# EAGLE design Training_Board (EAGLE 9.1.1)
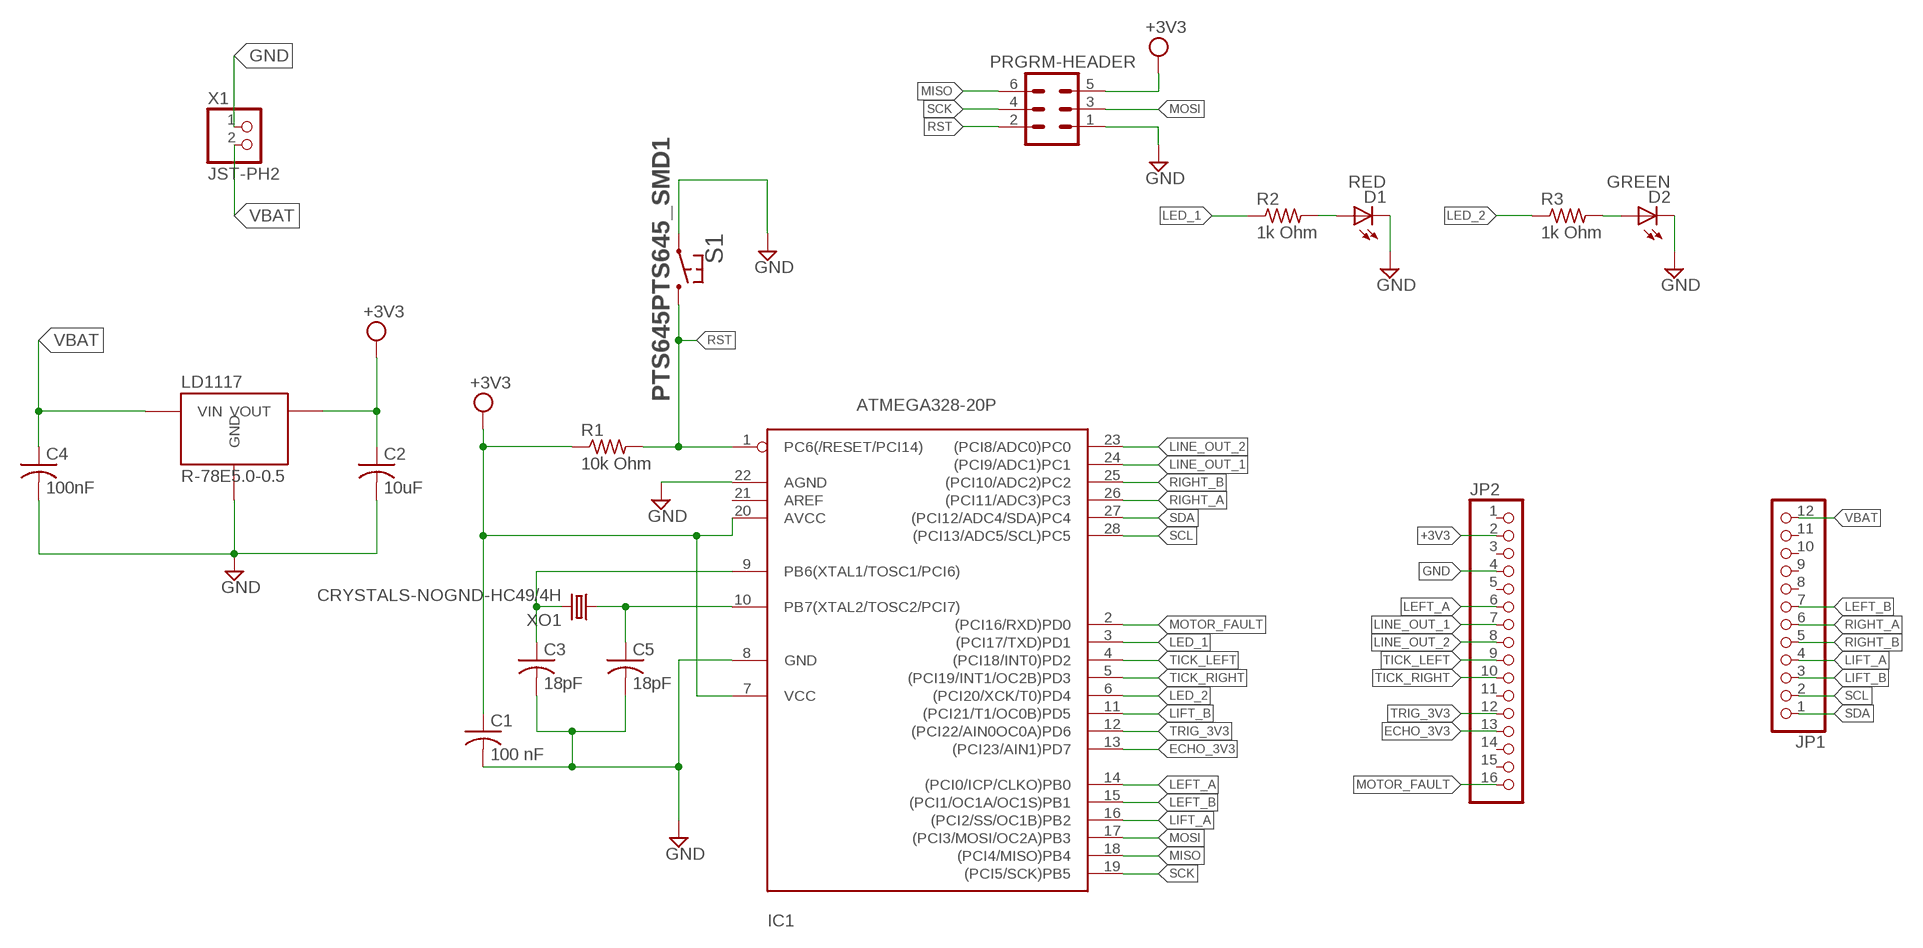
[diagram p0: schematic, sheet 1]

## Parts
C1  100 nF  C-USC0603  [C0603]
C2  10uF  C-USC0603  [C0603]
C3  18pF  C-USC0603  [C0603]
C4  100nF  C-USC0603  [C0603]
C5  18pF  C-USC0603  [C0603]
D1  RED  LEDCHIP-LED0603  [CHIP-LED0603]
D2  GREEN  LEDCHIP-LED0603  [CHIP-LED0603]
IC1  ATMEGA328-20P  [DIL28-3]
JP1  PINHD-1X12  [1X12]
JP2  PINHD-1X16  [1X16]
LD1117  R-78E5.0-0.5  [R-78E]
PRGRM-HEADER  MA03-2  [MA03-2]
R1  10k Ohm  R-US_R0603  [R0603]
R2  1k Ohm  R-US_M0805  [M0805]
R3  1k Ohm  R-US_M0805  [M0805]
S1  PTS645PTS645_SMD1  [PTS645_SMD]
X1  JST-PH2  [JST-PH]
XO1  CRYSTALS-NOGND-HC49/4H  [HC49]

## Nets
+3V3: C1.1 C2.1 IC1.7(VCC) IC1.20(AVCC) JP2.2 LD1117.3(VOUT) PRGRM-HEADER.5 R1.1
ECHO_3V3: IC1.13((PCI23/AIN1)PD7) JP2.13
GND: C1.2 C2.2 C3.2 C4.2 C5.2 D1.C D2.C IC1.8(GND) IC1.22(AGND) JP2.4 LD1117.2(GND) PRGRM-HEADER.1 S1.P$1 S1.P$2 X1.1
LED_1: IC1.3((PCI17/TXD)PD1) R2.1
LED_2: IC1.6((PCI20/XCK/T0)PD4) R3.1
LEFT_A: IC1.14((PCI0/ICP/CLKO)PB0) JP2.6
LEFT_B: IC1.15((PCI1/OC1A/OC1S)PB1) JP1.7
LIFT_A: IC1.16((PCI2/SS/OC1B)PB2) JP1.4
LIFT_B: IC1.11((PCI21/T1/OC0B)PD5) JP1.3
LINE_OUT_1: IC1.24((PCI9/ADC1)PC1) JP2.7
LINE_OUT_2: IC1.23((PCI8/ADC0)PC0) JP2.8
MISO: IC1.18((PCI4/MISO)PB4) PRGRM-HEADER.6
MOSI: IC1.17((PCI3/MOSI/OC2A)PB3) PRGRM-HEADER.3
MOTOR_FAULT: IC1.2((PCI16/RXD)PD0) JP2.16
N$1: C3.1 IC1.9(PB6(XTAL1/TOSC1/PCI6)) XO1.2
N$2: D2.A R3.2
N$3: D1.A R2.2
N$4: C5.1 IC1.10(PB7(XTAL2/TOSC2/PCI7)) XO1.1
RIGHT_A: IC1.26((PCI11/ADC3)PC3) JP1.6
RIGHT_B: IC1.25((PCI10/ADC2)PC2) JP1.5
RST: IC1.1(PC6(/RESET/PCI14)) PRGRM-HEADER.2 R1.2 S1.P$3 S1.P$4
SCK: IC1.19((PCI5/SCK)PB5) PRGRM-HEADER.4
SCL: IC1.28((PCI13/ADC5/SCL)PC5) JP1.2
SDA: IC1.27((PCI12/ADC4/SDA)PC4) JP1.1
TICK_LEFT: IC1.4((PCI18/INT0)PD2) JP2.9
TICK_RIGHT: IC1.5((PCI19/INT1/OC2B)PD3) JP2.10
TRIG_3V3: IC1.12((PCI22/AIN0OC0A)PD6) JP2.12
VBAT: C4.1 JP1.12 LD1117.1(VIN) X1.2
Unconnected: IC1.21(AREF) JP1.8 JP1.9 JP1.10 JP1.11 JP2.1 JP2.3 JP2.5 JP2.11 JP2.14 JP2.15

## Library data of the parts
C1 C3 C5 = resistor:C-US: CAPACITOR, American symbol
C2 C4 = rcl:C-US: CAPACITOR, American symbol; SPICEPREFIX: C
D1 D2 = led:LED: LED OSRAM: - CHIPLED LG R971, LG N971, LY N971, LG Q971, LY Q971, LO R971, LY R971 LH N974, LH R974 LS Q976, LO Q976, LY Q976 LO Q996 - Hyper CHIPLED LW Q18S LB Q993, LB Q99A, LB R99A - SideLED LS A670, LO A670, LY A670, LG A670, LP A670 LB A673, LV A673, LT A673, LW A673 LH A674 LY A675 LS A676, LA A676, LO A676, LY A676, LW A676 LS A679, LY A679, LG A679 - Hyper Micro SIDELED® LS Y876, LA Y876, LO Y876, LY Y876 LT Y87S - SmartLED LW L88C, LW L88S LB L89C, LB L89S, LG L890 LS L89K, LO L89K, LY L89K LS L896, LA L896, LO L896, LY L896 - TOPLED LS T670, LO T670, LY T670, LG T670, LP T670 LSG T670, LSP T670, LSY T670, LOP T670, LYG T670 LG T671, LOG T671, LSG T671 LB T673, LV T673, LT T673, LW T673 LH T674 LS T676, LA T676, LO T676, LY T676, LB T676, LH T676, LSB T676, LW T676 LB T67C, LV T67C, LT T67C, LS T67K, LO T67K, LY T67K, LW E67C LS E67B, LA E67B, LO E67B, LY E67B, LB E67C, LV E67C, LT E67C LW T67C LS T679, LY T679, LG T679 LS T770, LO T770, LY T770, LG T770, LP T770 LB T773, LV T773, LT T773, LW T773 LH T774 LS E675, LA E675, LY E675, LS T675 LS T776, LA T776, LO T776, LY T776, LB T776 LHGB T686 LT T68C, LB T68C - Hyper Mini TOPLED® LB M676 - Mini TOPLED Santana® LG M470 LS M47K, LO M47K, LY M47K Source: http://www.osram.convergy.de LUXEON: - LUMILED® LXK2-PW12-R00, LXK2-PW12-S00, LXK2-PW14-U00, LXK2-PW14-V00 LXK2-PM12-R00, LXK2-PM12-S00, LXK2-PM14-U00 LXK2-PE12-Q00, LXK2-PE12-R00, LXK2-PE12-S00, LXK2-PE14-T00, LXK2-PE14-U00 LXK2-PB12-K00, LXK2-PB12-L00, LXK2-PB12-M00, LXK2-PB14-N00, LXK2-PB14-P00, LXK2-PB14-Q00 LXK2-PR12-L00, LXK2-PR12-M00, LXK2-PR14-Q00, LXK2-PR14-R00 LXK2-PD12-Q00, LXK2-PD12-R00, LXK2-PD12-S00 LXK2-PH12-R00, LXK2-PH12-S00 LXK2-PL12-P00, LXK2-PL12-Q00, LXK2-PL12-R00 Source: www.luxeon.com KINGBRIGHT: KA-3528ASYC Source: www.kingbright.com
IC1 = atmega328:ATMEGA328*P: MICROCONTROLLER 32 kBytes FLASH 2 kBytes SRAM 1 kBytes EEPROM USART 8-channel 10 bit ADC
JP1 = pinhead:PINHD-1X12: PIN HEADER
JP2 = pinhead:PINHD-1X16: PIN HEADER
LD1117 = RoboJackets-PowerICs:R-78E5.0-0.5
PRGRM-HEADER = con-lstb:MA03-2: PIN HEADER; OC_FARNELL: unknown; OC_NEWARK: unknown
R1 = resistor:R-US_: RESISTOR, American symbol
R2 R3 = rcl:R-US_: RESISTOR, American symbol; SPICEPREFIX: R
S1 = RoboJackets-Switches:PTS645: Tactile Momentary Pushbutton with thru-hole legs. https://www.ckswitches.com/media/1471/pts645.pdf
X1 = Trainii:JST-PH2
XO1 = IQD-Frequency-Products:CRYSTALS-NOGND: CRYSTALS CAN NOT GROUNDED

## Board
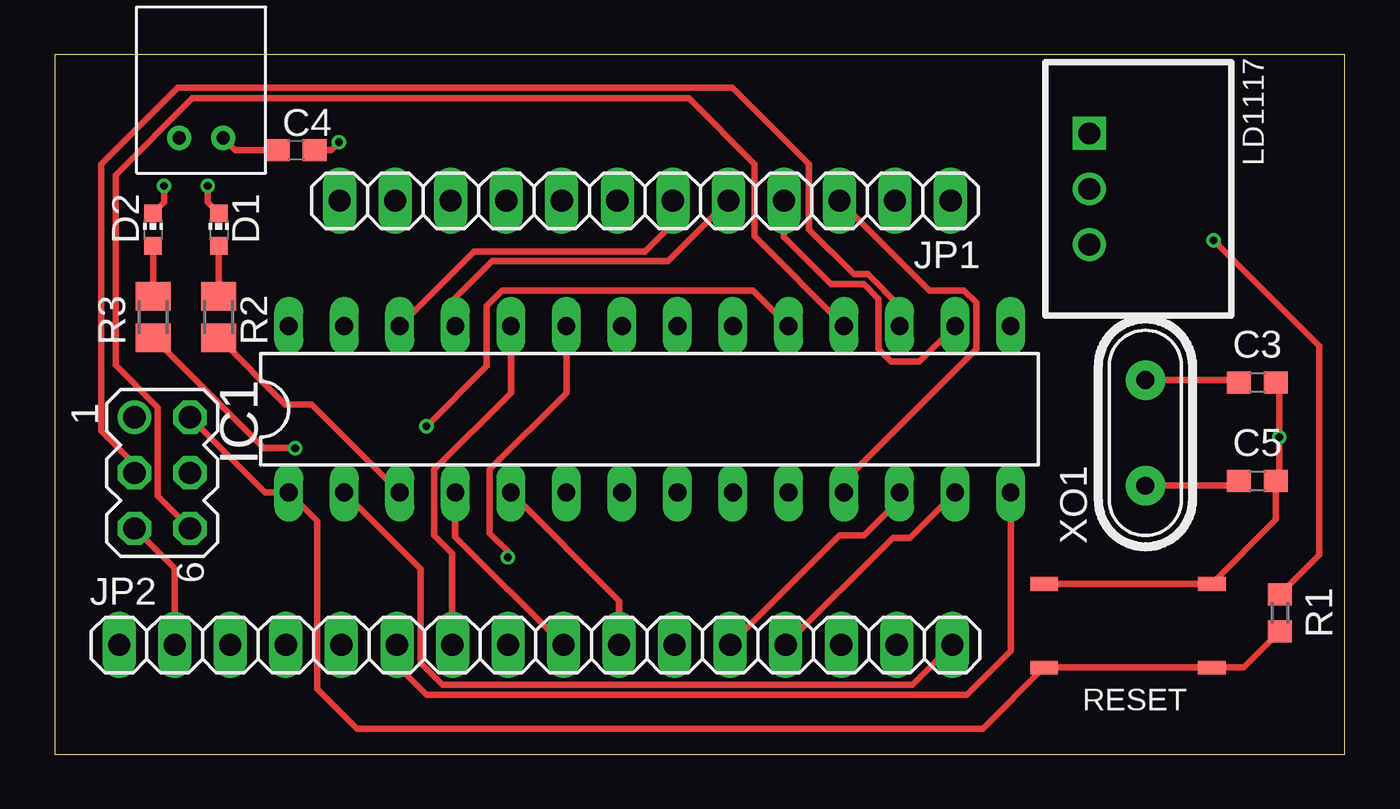
[diagram p1: board, top side]
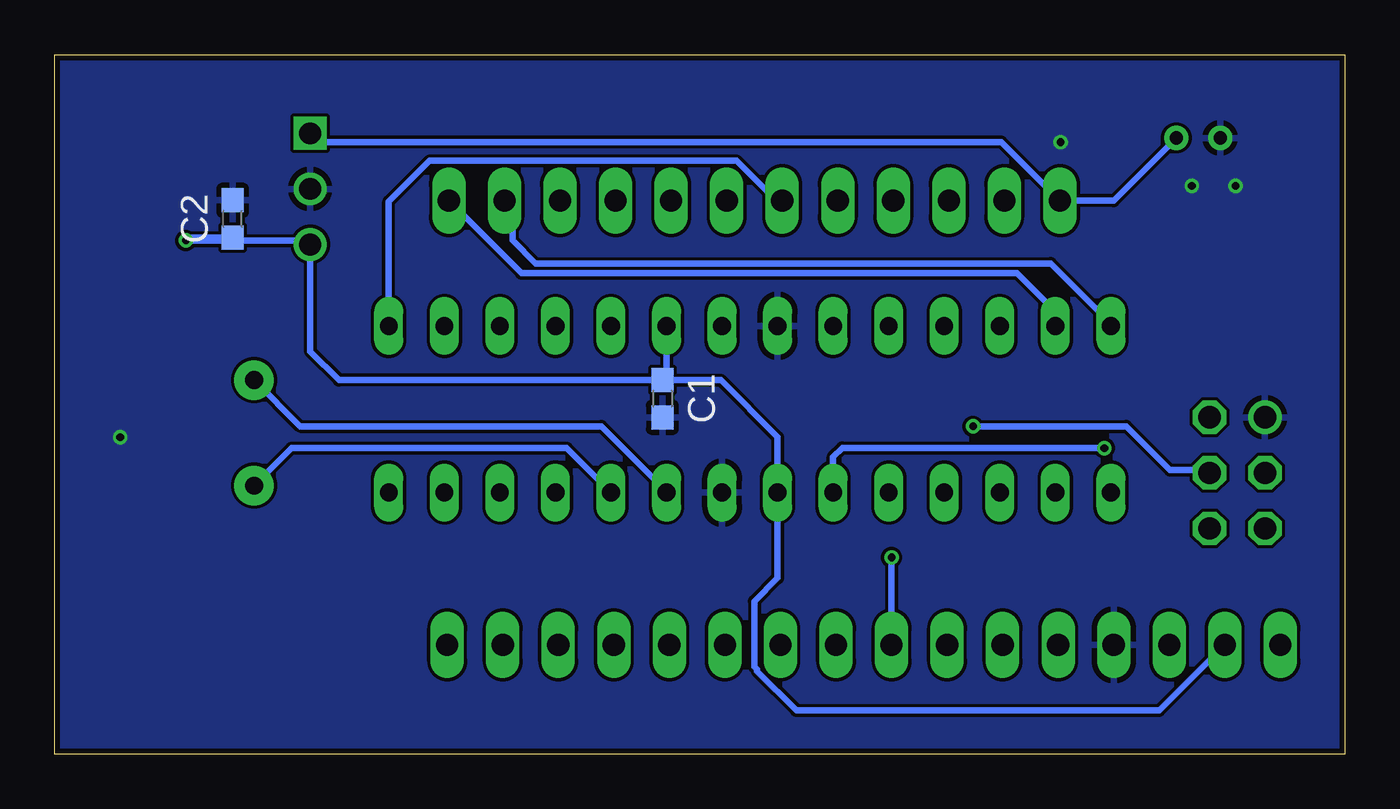
[diagram p2: board, bottom side, seen from below]

Size 59 x 32 mm. Coordinates in mm from the lower left corner, seen from the top.
Outline: 0,0 59,0 59,32 0,32 0,0
Copper layers (1*16): Top 0.035mm / dielectric 1.5mm / Bottom 0.035mm
Design rules "SeeedStudio": minimum track width 6mil, minimum drill 12mil, track to track 6mil, track to pad 6mil, pad to pad 6mil, via to via 6mil, smd to smd 0mil, copper to edge 10mil, drill to drill 10mil, minimum pad ring 10mil, minimum via ring 6mil, stop-mask expansion 2mil, vias tented up to drill 100mil, thermal gap 10mil

### Footprints (pad centres in the part's own frame; a part is rotated, then mirrored left to right if it is on the bottom)
C0603 = smd 1.1 x 1: 1 -0.85,0; 2 0.85,0
CHIP-LED0603 = smd 0.8 x 0.8: A 0,-0.75; C 0,0.75
DIL28-3 = drill 0.813 long: 1 -16.51,-3.81; 2 -13.97,-3.81; 3 -11.43,-3.81; 4 -8.89,-3.81; 5 -6.35,-3.81; 6 -3.81,-3.81; 7 -1.27,-3.81; 8 1.27,-3.81; 9 3.81,-3.81; 10 6.35,-3.81; 11 8.89,-3.81; 12 11.43,-3.81; 13 13.97,-3.81; 14 16.51,-3.81; 15 16.51,3.81; 16 13.97,3.81; 17 11.43,3.81; 18 8.89,3.81; 19 6.35,3.81; 20 3.81,3.81; 21 1.27,3.81; 22 -1.27,3.81; 23 -3.81,3.81; 24 -6.35,3.81; 25 -8.89,3.81; 26 -11.43,3.81; 27 -13.97,3.81; 28 -16.51,3.81
1X12 = drill 1.016 long: 1 -13.97,0; 2 -11.43,0; 3 -8.89,0; 4 -6.35,0; 5 -3.81,0; 6 -1.27,0; 7 1.27,0; 8 3.81,0; 9 6.35,0; 10 8.89,0; 11 11.43,0; 12 13.97,0
1X16 = drill 1.016 long: 1 -19.05,0; 2 -16.51,0; 3 -13.97,0; 4 -11.43,0; 5 -8.89,0; 6 -6.35,0; 7 -3.81,0; 8 -1.27,0; 9 1.27,0; 10 3.81,0; 11 6.35,0; 12 8.89,0; 13 11.43,0; 14 13.97,0; 15 16.51,0; 16 19.05,0
R-78E = drill 1 square: 1 -2.54,0 | drill 1: 2 0,0; 3 2.54,0
MA03-2 = drill 1.016: 1 -2.54,-1.27 | drill 1.016 octagon: 2 -2.54,1.27; 3 0,-1.27; 4 0,1.27; 5 2.54,-1.27; 6 2.54,1.27
R0603 = smd 1 x 1.1: 1 -0.85,0; 2 0.85,0
M0805 = smd 1.3 x 1.6: 1 -0.95,0; 2 0.95,0
PTS645_SMD = smd 1.27 x 0.635: P$1 -3.835,1.917; P$2 3.835,1.917; P$3 3.835,-1.917; P$4 -3.835,-1.917
JST-PH = drill 0.6: 1 -1,0; 2 1,0
HC49 = drill 0.813 pad 1.8: 1 -2.413,0; 2 2.413,0

### Placement (x,y rotation side)
C1  31.21,16.26 270 bottom
C2  50.86,24.49 90 bottom
C3  55,17 0 top
C4  11.04,27.64 0 top
C5  55,12.5 0 top
D1  7.5,24 0 top
D2  4.5,24 0 top
IC1  27.21,15.78 0 top
JP1  27,25.32 180 top
JP2  22,5 0 top
LD1117  47.31,25.86 270 top
PRGRM-HEADER  4.92,12.87 270 top
R1  56.03,6.47 270 top
R2  7.5,20 90 top
R3  4.5,20 90 top
S1  49.08,5.88 0 top
X1  6.7,28.19 0 top
XO1  49.88,14.7 90 top

### Tracks (layer width: path | path; a pad name or v marks a point on that pad's centre or on a via)
+3V3  (via drill 0.35)
  Top 0.3: R1.1 57.83,9.12 57.83,18.67 v53,23.5 | PRGRM-HEADER.5 5.49,8.49 JP2.2
  Bottom 0.3: IC1.20 31.02,17.3 C1.1 | C1.1 46,17.11 47.31,18.42 47.31,23 | LD1117.3 47.31,23 | C1.1 28.54,17.11 25.94,14.51 IC1.7 25.94,8.06 27,7 27,4 26.87,3.87 26.87,3.8 25.08,2 8.49,2 JP2.2 | C2.1 51.04,23.63 52.87,23.63 v53,23.5 47.81,23.5 47.31,23
ECHO_3V3
  Top 0.3: IC1.13 39.1,9.89 38.33,9.89 JP2.13
GND  (via drill 0.35)
  Top 0.3: C3.2 56,16.85 v56,14.5 56,12.65 C5.2 55.85,10.73 S1.P$2 S1.P$1 | C4.2 12.64,27.64 v13,28 | D2.C 5,25.25 v5,26 | D1.C 7,25.25 v7,26
  pour Bottom: 0,0 0,32 59,32 59,0
LED_1
  Top 0.3: R2.1 10.55,16 11.75,16 IC1.3
LED_2  (via drill 0.35)
  Top 0.3: R3.1 9.55,14 v11,14
  Bottom 0.3: v11,14 11.02,14.02 22.98,14.02 23.4,13.6 IC1.6
LEFT_A
  Top 0.3: JP2.6 15.65,4.07 17,2.72 41.72,2.72 43.72,4.72 IC1.14
LEFT_B
  Bottom 0.3: JP1.7 26,25.32 27.83,27.15 41.85,27.15 43.72,25.28 IC1.15
LIFT_A
  Top 0.3: JP1.4 33.35,23.65 35.5,21.5 37,21.5 37.68,20.82 37.68,18.53 38.24,17.97 39.56,17.97 IC1.16
LIFT_B
  Top 0.3: IC1.11 36.1,12.49 42.14,18.53 42.14,20.65 41.58,21.21 40,21.21 JP1.3
LINE_OUT_1
  Top 0.3: IC1.24 20.86,16.53 17.36,13.03 17.36,10 18.18,9.18 18.18,5.18 18.09,5.1 JP2.7
LINE_OUT_2  (via drill 0.35)
  Top 0.3: IC1.23 23.4,16.53 19.9,13.03 19.9,10.1 | v20.73,9 20.73,9.27 19.9,10.1 | 19.9,10.1
  Bottom 0.3: v20.73,9 JP2.8
MISO
  Top 0.3: IC1.18 32,23.69 32,27 29,30 6.3,30 2.79,26.49 2.79,17.79 4.71,15.87 4.71,11.81 PRGRM-HEADER.6
MOSI
  Top 0.3: PRGRM-HEADER.3 3.65,13.27 2.13,14.78 2.13,27 5.63,30.5 31,30.5 34.5,27 34.5,24 36.55,21.95 37.19,21.95 38.64,20.5 IC1.17
MOTOR_FAULT
  Top 0.3: JP2.16 39.22,3.17 17.75,3.17 16.74,4.18 16.74,8.47 IC1.2
N$1
  Top 0.3: XO1.2 54.04,17.11 C3.1
  Bottom 0.3: XO1.2 47.77,15 34,15 31.02,12.02 IC1.9
N$2
  Top 0.3: R3.2 D2.A
N$3
  Top 0.3: D1.A R2.2
N$4
  Top 0.3: XO1.1 53.94,12.29 C5.1
  Bottom 0.3: IC1.10 35.59,14 48.17,14 XO1.1
RIGHT_A
  Top 0.3: JP1.6 28.27,24.27 27,23 19.19,23 IC1.26
RIGHT_B
  Top 0.3: JP1.5 28.04,22.55 20,22.55 18.32,20.87 IC1.25
RST
  Top 0.3: R1.2 54.37,3.96 S1.P$3 S1.P$4 42.45,1.17 13.83,1.17 12,3 12,10.67 IC1.1 9.63,11.97 PRGRM-HEADER.2
SCK  (via drill 0.35)
  Top 0.3: IC1.19 31.94,21.21 20.46,21.21 19.75,20.5 19.75,17.75 v17,15
  Bottom 0.3: v17,15 10,15 8,13 6.32,13 PRGRM-HEADER.4
SCL
  Bottom 0.3: JP1.2 38.05,24.95 38.05,23.51 37,22.45 13.45,22.45 10.7,19.7 IC1.28
SDA
  Bottom 0.3: JP1.1 37.65,22 15,22 13.24,20.24 IC1.27
TICK_LEFT
  Top 0.3: IC1.4 18.32,10 18.32,9.95 JP2.9
TICK_RIGHT
  Top 0.3: IC1.5 25.81,7.02 JP2.10
TRIG_3V3
  Top 0.3: IC1.12 38.64,11.64 37,10 35.89,10 JP2.12
VBAT
  Top 0.3: X1.2 8.25,27.64 C4.1
  Bottom 0.3: LD1117.1 46.91,28 15.71,28 JP1.12 10.57,25.32 X1.2

### Text on the board
tPlace: RESET